# EAGLE schematic esp_energy (EAGLE 9.5.2)
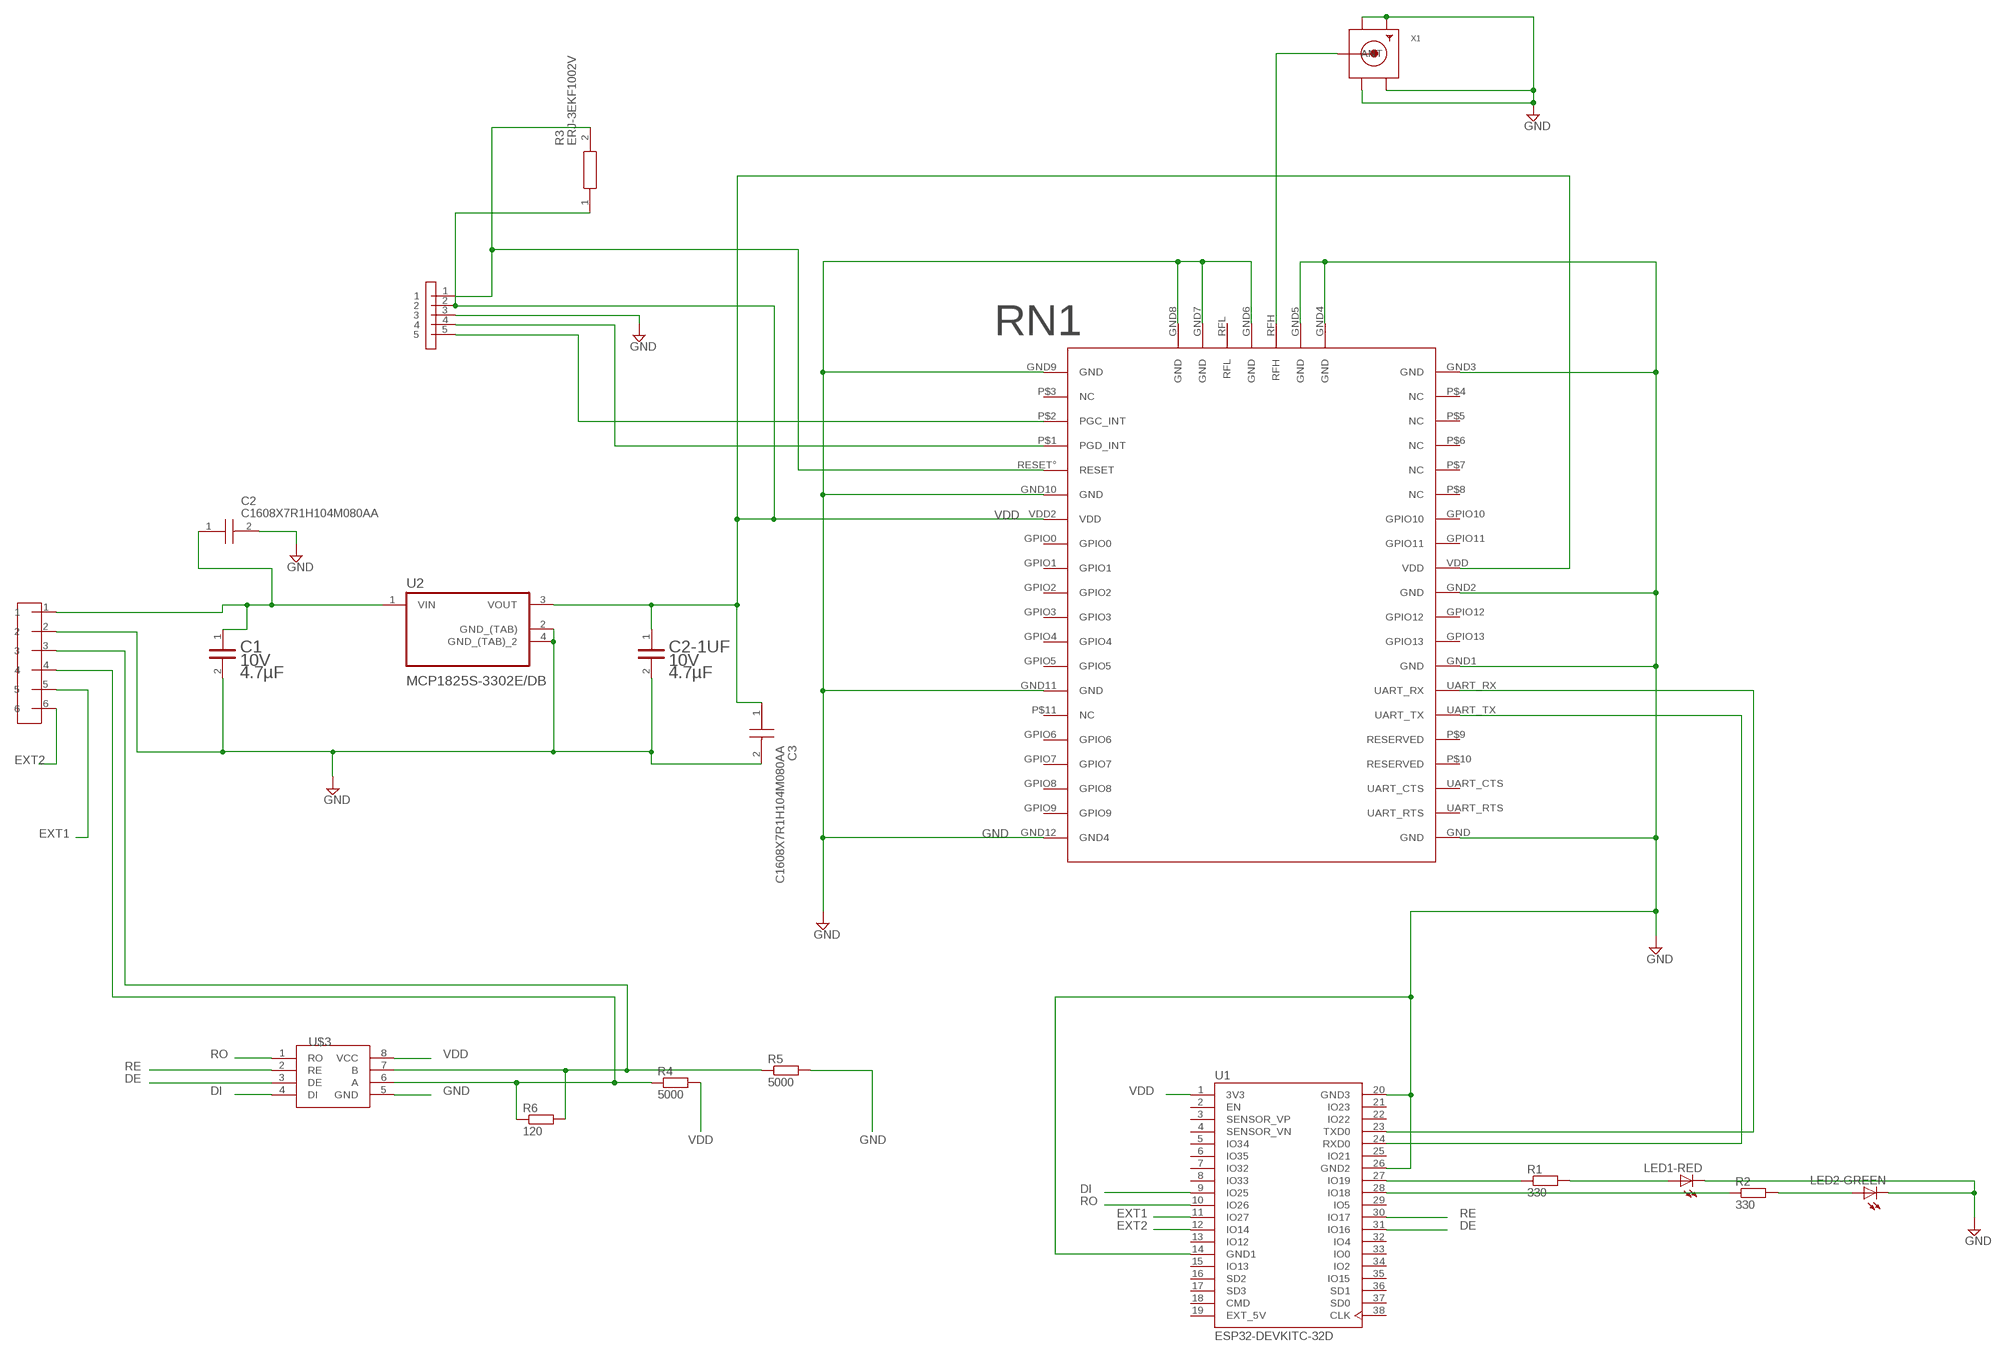
[diagram p0: schematic, sheet 1]

## Parts
C1  KEMET_C0603C475K8PACTUKEMET_C0603C475K8PACTU_0_0  [KEMET_C0603C475K8PACTU_0]
C2  C1608X7R1H104M080AA  [CAPC1608X80N]
C2-1UF  KEMET_C0603C475K8PACTUKEMET_C0603C475K8PACTU_0_0  [KEMET_C0603C475K8PACTU_0]
C3  C1608X7R1H104M080AA  [CAPC1608X80N]
LED1-RED  LEDCHIP-LED0603  [CHIP-LED0603]
LED2-GREEN  LEDCHIP-LED0603  [CHIP-LED0603]
R1  330  R-EU_R0603  [R0603]
R2  330  R-EU_R0603  [R0603]
R3  ERJ-3EKF1002V  [RESC1608X55N]
R4  5000  R-EU_R0805  [R0805]
R5  5000  R-EU_R0805  [R0805]
R6  120  R-EU_R0805  [R0805]
RN1  NEW_RN2483  [NEW_RN2483]
U1  ESP32-DEVKITC-32D  [MODULE_ESP32-DEVKITC-32D]
U2  MCP1825S-3302E/DB  [SOT230P700X180-4N]
U$1  CONNECTOR62  [CONNECTOR6]
U$2  ICSP52  [ICSP]
U$3  AMD3485E  [AMD3485E]
X1  SMACONNECTOR_EDGE  [SMA_EDGELAUNCH]

## Nets
DE: U1.31(IO16) U$3.3(DE)
DI: U1.9(IO25) U$3.4(DI)
EXT1: U1.11(IO27) U$1.5
EXT2: U1.12(IO14) U$1.6
GND: C1.2 C2-1UF.2 C2.2 C3.2 LED1-RED.C LED2-GREEN.C R5.2 RN1.GND RN1.GND1(GND) RN1.GND2(GND) RN1.GND3(GND) RN1.GND4(GND) RN1.GND5(GND) RN1.GND6(GND) RN1.GND7(GND) RN1.GND8(GND) RN1.GND9(GND) RN1.GND10(GND) RN1.GND11(GND) RN1.GND12(GND4) U1.14(GND1) U1.20(GND3) U1.26(GND2) U2.2(GND_(TAB)) U2.4(GND_(TAB)_2) U$1.2 U$2.3 U$3.5(GND) X1.GND@1(GND4) X1.GND@2(GND3) X1.GND@3(GND2) X1.GND@4(GND1)
N$1: R1.1 U1.27(IO19)
N$2: LED1-RED.A R1.2
N$3: C1.1 C2.1 U2.1(VIN) U$1.1
N$4: R2.1 U1.28(IO18)
N$5: LED2-GREEN.A R2.2
N$6: R3.2 RN1.RESET°(RESET) U$2.1
N$7: RN1.P$1(PGD_INT) U$2.4
N$8: RN1.UART_RX U1.23(TXD0)
N$9: RN1.P$2(PGC_INT) U$2.5
N$10: RN1.RFH X1.P(ANT)
N$11: R5.1 R6.2 U$1.3 U$3.7(B)
N$12: R4.1 R6.1 U$1.4 U$3.6(A)
N$13: RN1.UART_TX U1.24(RXD0)
RE: U1.30(IO17) U$3.2(RE)
RO: U1.10(IO26) U$3.1(RO)
VDD: C2-1UF.1 C3.1 R3.1 R4.2 RN1.VDD RN1.VDD2(VDD) U1.1(3V3) U2.3(VOUT) U$2.2 U$3.8(VCC)
Unconnected: RN1.GPIO0 RN1.GPIO1 RN1.GPIO2 RN1.GPIO3 RN1.GPIO4 RN1.GPIO5 RN1.GPIO6 RN1.GPIO7 RN1.GPIO8 RN1.GPIO9 RN1.GPIO10 RN1.GPIO11 RN1.GPIO12 RN1.GPIO13 RN1.P$3(NC) RN1.P$4(NC) RN1.P$5(NC) RN1.P$6(NC) RN1.P$7(NC) RN1.P$8(NC) RN1.P$9(RESERVED) RN1.P$10(RESERVED) RN1.P$11(NC) RN1.RFL RN1.UART_CTS RN1.UART_RTS U1.2(EN) U1.3(SENSOR_VP) U1.4(SENSOR_VN) U1.5(IO34) U1.6(IO35) U1.7(IO32) U1.8(IO33) U1.13(IO12) U1.15(IO13) U1.16(SD2) U1.17(SD3) U1.18(CMD) U1.21(IO23) U1.22(IO22) U1.25(IO21) U1.29(IO5) U1.32(IO4) U1.33(IO0) U1.34(IO2) U1.35(IO15) U1.36(SD1) U1.37(SD0) U1.38(CLK)

## Power pins joined to a net without a drawn wire
EXT_5V: U1.19(EXT_5V)

## Library data of the parts
C1 C2-1UF = Kemet - C0603C475K8PACTU:KEMET_C0603C475K8PACTU: CAP CER 4.7UF 10V X5R 0603; CAPACITANCE: 4.7µF; CENTROID_NOT_SPECIFIED: No; DATASHEET: https://search.kemet.com/component-edge/download/datasheet/C0603C475K8PACTU.pdf; DIGIKEY_DESCRIPTION: CAP CER 4.7UF 10V X5R 0603; DIGIKEY_PART_NUMBER: 399-5503-1-ND; LEAD_FREE: yes; MF: Kemet; MFG_PACKAGE_IDENT: C0603; MOUSER_DESCRIPTION: Multilayer Ceramic Capacitors MLCC - SMD/SMT 10volts 4.7uF 10% X5R; MOUSER_PART_NUMBER: 80-C0603C475K8P; MPN: C0603C475K8PACTU; PACKAGE: 0603; PREFIX: C; ROHS: yes; TEMPERATURE_RANGE_HIGH: +85°C; TEMPERATURE_RANGE_LOW: -55°C; VOLTAGE: 10V
C2 C3 = C1608X7R1H104M080AA:C1608X7R1H104M080AA: TDK 0603 C 100nF Ceramic Multilayer Capacitor, 50 V dc, +125C, X7R Dielectric, +/-20% Source: Datasheet <https://product.tdk.com/info/en/catalog/datasheets/mlcc_commercial_midvoltage_en.pdf>; ARROW_PART_NUMBER: C1608X7R1H104M080AA; ARROW_PRICE-STOCK: https://www.arrow.com/en/products/c1608x7r1h104m080aa/tdk; DESCRIPTION: TDK 0603 C 100nF Ceramic Multilayer Capacitor, 50 V dc, +125C, X7R Dielectric, +/-20%; HEIGHT: 0.8mm; MANUFACTURER_NAME: TDK; MANUFACTURER_PART_NUMBER: C1608X7R1H104M080AA; MOUSER_PART_NUMBER: 810-C1608X7R1H104M; MOUSER_PRICE-STOCK: https://www.mouser.co.uk/ProductDetail/TDK/C1608X7R1H104M080AA?qs=dfay7wIA1uEL2BE%2FFUaTdg%3D%3D
LED1-RED LED2-GREEN = adafruit:LED: LED OSRAM: - CHIPLED LG R971, LG N971, LY N971, LG Q971, LY Q971, LO R971, LY R971 LH N974, LH R974 LS Q976, LO Q976, LY Q976 LO Q996 - Hyper CHIPLED LW Q18S LB Q993, LB Q99A, LB R99A - SideLED LS A670, LO A670, LY A670, LG A670, LP A670 LB A673, LV A673, LT A673, LW A673 LH A674 LY A675 LS A676, LA A676, LO A676, LY A676, LW A676 LS A679, LY A679, LG A679 - Hyper Micro SIDELED® LS Y876, LA Y876, LO Y876, LY Y876 LT Y87S - SmartLED LW L88C, LW L88S LB L89C, LB L89S, LG L890 LS L89K, LO L89K, LY L89K LS L896, LA L896, LO L896, LY L896 - TOPLED LS T670, LO T670, LY T670, LG T670, LP T670 LSG T670, LSP T670, LSY T670, LOP T670, LYG T670 LG T671, LOG T671, LSG T671 LB T673, LV T673, LT T673, LW T673 LH T674 LS T676, LA T676, LO T676, LY T676, LB T676, LH T676, LSB T676, LW T676 LB T67C, LV T67C, LT T67C, LS T67K, LO T67K, LY T67K, LW E67C LS E67B, LA E67B, LO E67B, LY E67B, LB E67C, LV E67C, LT E67C LW T67C LS T679, LY T679, LG T679 LS T770, LO T770, LY T770, LG T770, LP T770 LB T773, LV T773, LT T773, LW T773 LH T774 LS E675, LA E675, LY E675, LS T675 LS T776, LA T776, LO T776, LY T776, LB T776 LHGB T686 LT T68C, LB T68C - Hyper Mini TOPLED® LB M676 - Mini TOPLED Santana® LG M470 LS M47K, LO M47K, LY M47K Source: http://www.osram.convergy.de/
R1 R2 R4-R6 = rcl:R-EU_: RESISTOR, European symbol; SPICEPREFIX: R
R3 = ERJ-3EKF1002V:ERJ-3EKF1002V: Thick Film Resistors - SMD 0603 10Kohms 1% AEC-Q200 Source: Datasheet <http://industrial.panasonic.com/cdbs/www-data/pdf/RDA0000/AOA0000C86.pdf>; ARROW_PART_NUMBER: ERJ-3EKF1002V; ARROW_PRICE-STOCK: https://www.arrow.com/en/products/erj-3ekf1002v/panasonic; DESCRIPTION: Thick Film Resistors - SMD 0603 10Kohms 1% AEC-Q200; HEIGHT: 0.55mm; MANUFACTURER_NAME: Panasonic; MANUFACTURER_PART_NUMBER: ERJ-3EKF1002V; MOUSER_PART_NUMBER: 667-ERJ-3EKF1002V; MOUSER_PRICE-STOCK: https://www.mouser.co.uk/ProductDetail/Panasonic/ERJ-3EKF1002V?qs=H7k1u0Mp9JSrGPQ5%2F5COuw%3D%3D
RN1 = tobias:NEW_RN2483
U1 = ESP32-DEVKITC-32D:ESP32-DEVKITC-32D: Eval Board For Esp-Wroom-32; AVAILABILITY: Unavailable; DESCRIPTION: - Transceiver; 802.11 b/g/n (Wi-Fi, WiFi, WLAN), Bluetooth® Smart Ready 4.x Dual Mode For Use With ESP-WROOM-32; MF: Espressif Systems; MP: ESP32-DEVKITC-32D; PACKAGE: None; PRICE: None
U2 = MCP1825S-3302E_DB:MCP1825S-3302E/DB; AVAILABILITY: Unavailable; DESCRIPTION: Linear Voltage Regulator IC 1 Output 500mA SOT-223-3; MF: Microchip; MP: MCP1825S-3302E/DB; PACKAGE: SOT-223 Microchip; PRICE: None
U$1 = conn4:CONNECTOR62
U$2 = conn4:ICSP52
U$3 = AMD3485E:AMD3485E
X1 = adafruit:SMACONNECTOR: SMA Connector 90° DIP SMA Connector, 50 Ohm (4UConnector: 07259)